# Altium schematic sheet Sheet1.SchDoc
size 420 x 297 mm; Author: axxxaxa; Scale: 1:1; DocumentType: Схема электрическая принципиальная; FirstReferrence: АБВГ.123456.001
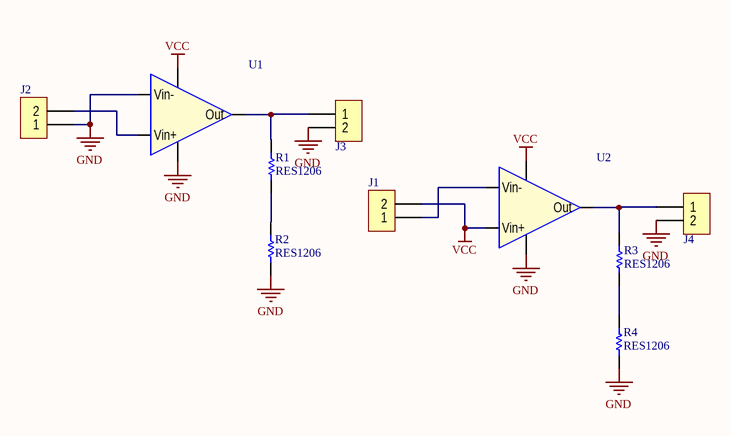
[diagram p0: Sheet1.SchDoc]

## Parts
J1  691311700002  [691311700002]  (value not drawn)
J2  691311700002  [691311700002]  (value not drawn)
J3  691311700002  [691311700002]  (value not drawn)
J4  691311700002  [691311700002]  (value not drawn)
R1  RES1206  [RESC1206(3216)_L]
R2  RES1206  [RESC1206(3216)_L]
R3  RES1206  [RESC1206(3216)_L]
R4  RES1206  [RESC1206(3216)_L]
U1  Texas Instruments INA138NA/3K  [SOT23-5]  (value not drawn)
U2  Texas Instruments INA138NA/3K  [SOT23-5]  (value not drawn)

## Nets
GND: J2.1 J3.2 J4.2 R2.1 R4.1 U1.2(V-) U1.4(Vin-) U2.2(V-)
VCC: J1.2 U1.5(V+) U2.3(Vin+) U2.5(V+)
NetJ1_1: J1.1 U2.4(Vin-)
NetJ2_2: J2.2 U1.3(Vin+)
NetJ3_1: J3.1 R1.2 U1.1(Out)
NetJ4_1: J4.1 R3.2 U2.1(Out)
NetR1_1: R1.1 R2.2
NetR3_1: R3.1 R4.2

## Notes on the sheet
- Перв. примен.
- Справ. №
- Подп. и дата
- Инв. № дубл.
- Взам. инв. №
- Разраб.
- Изм.
- Лист
- № докум.
- Подп.
- Дата
- Лит.
- Масса
- Масштаб
- Пров.
- Т.контр.
- Листов
- Инв. № подл.
- Утв.
- Н.контр.
- 2.106-A3
- Копировал
- Формат А3

## Library data of the parts
J1-J4 = 691311700002: WR-TBL Terminal block - serie 3117 - 5.00mm; Manufacturer: Würth Elektronik eiSos GmbH; ComponentLink1 Description: Manufacturer; ComponentLink2 Description: Datasheet; NoPins: 02; Created Date: 6 January 2014; partNo: 691311700002; ComponentLink1URL: http://www.we-online.com; ComponentLink2URL: http://katalog.we-online.de/em/datasheet/6913117000xx.pdf; Created by: Karrer Zheng
R1-R4 = CMP-1591-00005-1: 1206 (3216 Metric) Chip Resistor; Case-Metric: 3216; Case-EIA: 1206; PackageReference: RESC1206(3216)
U1 U2 = INA138